# Altium schematic sheet Peripheral Connections.SchDoc
size A; SheetNumber: 9; SheetTotal: 9
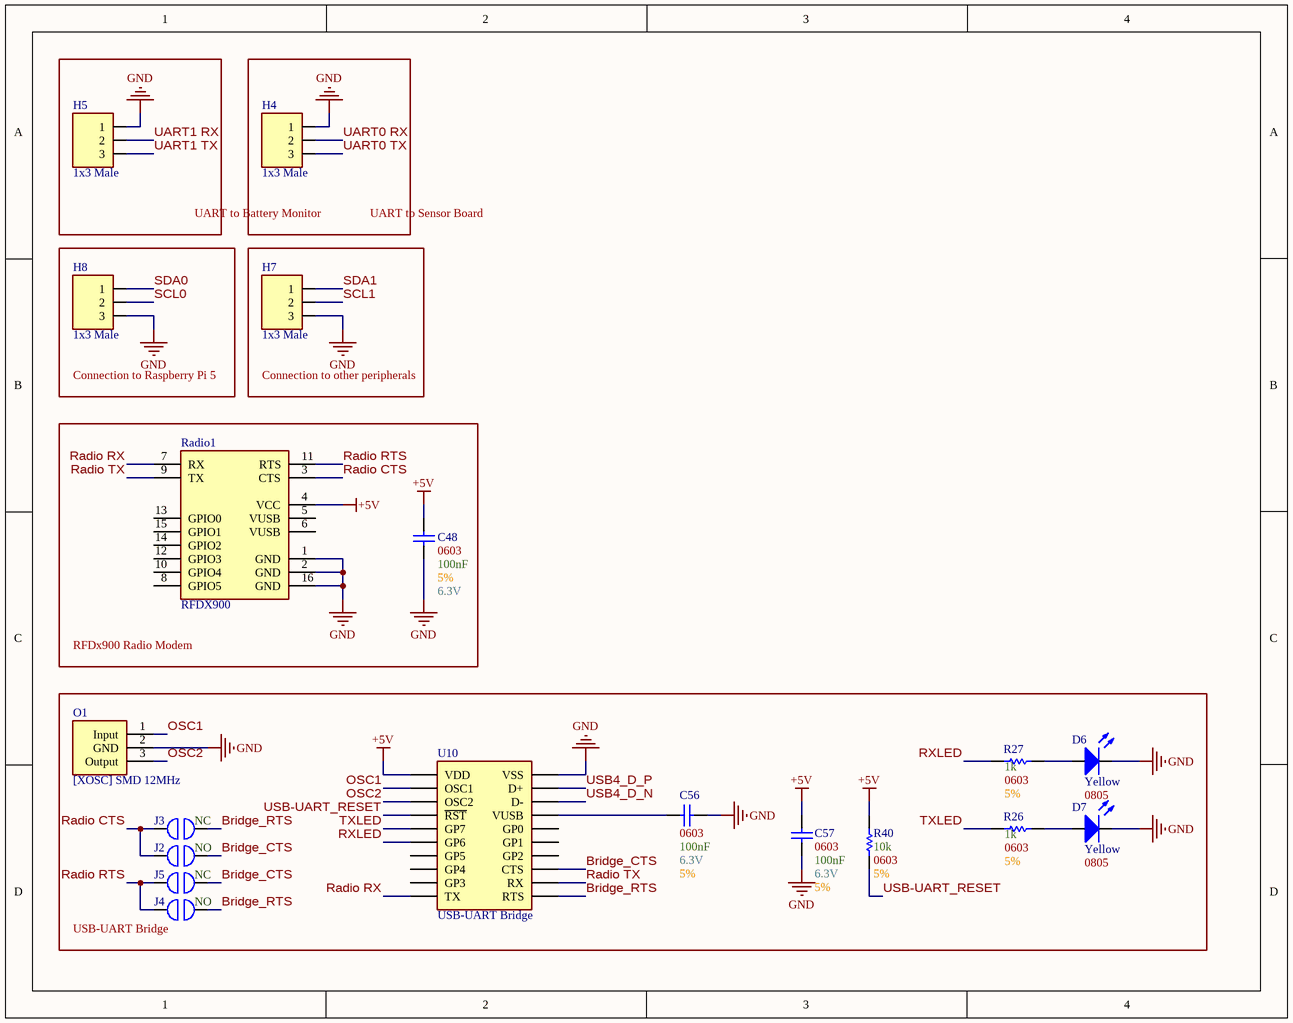
[diagram p0: Peripheral Connections.SchDoc]

## Parts
C48  Size Package: 0603  Capacitance: 100nF  Voltage: 6.3V  Tolerance: 5%  [[Cap] SMD 0603]  (hidden comment: [Cap] SMD Nonpolarized)
C56  Size Package: 0603  Capacitance: 100nF  Voltage: 6.3V  Tolerance: 5%  [[Cap] SMD 0603]  (hidden comment: [Cap] SMD Nonpolarized)
C57  Size Package: 0603  Capacitance: 100nF  Voltage: 6.3V  Tolerance: 5%  [[Cap] SMD 0603]  (hidden comment: [Cap] SMD Nonpolarized)
D6  Color: Yellow  Size Package: 0805  [[LED] SMD 0805]  (hidden comment: SMD LED)
D7  Color: Yellow  Size Package: 0805  [[LED] SMD 0805]  (hidden comment: SMD LED)
H4  1x3 Male  [[Header] Shrouded 1x3 Male]
H5  1x3 Male  [[Header] Shrouded 1x3 Male]
H7  1x3 Male  [[Header] Shrouded 1x3 Male]
H8  1x3 Male  [[Header] Shrouded 1x3 Male]
J2  NO/NC: NO  [[Jumper] Solderable Jumper]  (hidden comment: [Jump] SMD Jumper)  (no BOM)
J3  NO/NC: NC  [[Jumper] Solderable Jumper]  (hidden comment: [Jump] SMD Jumper)  (no BOM)
J4  NO/NC: NO  [[Jumper] Solderable Jumper]  (hidden comment: [Jump] SMD Jumper)  (no BOM)
J5  NO/NC: NC  [[Jumper] Solderable Jumper]  (hidden comment: [Jump] SMD Jumper)  (no BOM)
O1  [XOSC] SMD 12MHz  [[XOSC] SMD 12MHz]
R26  Resistance: 1k  Size Package: 0603  Tolerance: 5%  [[Res] SMD 0603]  (hidden comment: [Res] SMD Resistor)
R27  Resistance: 1k  Size Package: 0603  Tolerance: 5%  [[Res] SMD 0603]  (hidden comment: [Res] SMD Resistor)
R40  Resistance: 10k  Size Package: 0603  Tolerance: 5%  [[Res] SMD 0603]  (hidden comment: [Res] SMD Resistor)
Radio1  RFDX900  [[Device] RFDX900 Radio SMD Mount]
U10  USB-UART Bridge  [[IC] USB-UART Bridge]

## Blocks framed on the sheet
UART to Battery Monitor: H5
UART to Sensor Board: H4
Connection to Raspberry Pi 5: H8
Connection to other peripherals: H7
RFDx900 Radio Modem: C48 Radio1
USB-UART Bridge: C56 C57 D6 D7 J2-J5 O1 R26 R27 R40 U10

## Nets
+5V: C48.2 C57.2 R40.2 Radio1.4(VCC) U10.1(VDD)
GND: C48.1 C56.1 C57.1 D6.2(Cathode) D7.2(Cathode) H4.1 H5.1 H7.3 H8.3 O1.2(GND) Radio1.1(GND) Radio1.2(GND) Radio1.16(GND) U10.20(VSS)
Bridge_CTS: J2.2 J5.2 U10.13(CTS)
Bridge_RTS: J3.2 J4.2 U10.11(RTS)
OSC1: O1.1(Input) U10.2(OSC1)
OSC2: O1.3(Output) U10.3(OSC2)
Radio CTS: J2.1 J3.1 Radio1.3(CTS)
Radio RTS: J4.1 J5.1 Radio1.11(RTS)
Radio RX: Radio1.7(RX) U10.10(TX)
Radio TX: Radio1.9(TX) U10.12(RX)
RXLED: R27.2 U10.6(GP6)
SCL0: H8.2
SCL1: H7.2
SDA0: H8.1
SDA1: H7.1
TXLED: R26.2 U10.5(GP7)
UART0 RX: H4.2
UART0 TX: H4.3
UART1 RX: H5.2
UART1 TX: H5.3
USB4_D_N: U10.18(D-)
USB4_D_P: U10.19(D+)
USB-UART_RESET: R40.1 U10.4(~{RST})
NetC56_2: C56.2 U10.17(VUSB)
NetD6_1: D6.1(Anode) R27.1
NetD7_1: D7.1(Anode) R26.1

Not connected (* = marked no-connect by the designer): Radio1 5(VUSB) 6(VUSB) 8(GPIO5) 10(GPIO4) 12(GPIO3) 13(GPIO0) 14(GPIO2) 15(GPIO1); U10 7(GP5) 8(GP4) 9(GP3) 14(GP2) 15(GP1) 16(GP0)

## Library data of the parts
D6 D7 = [LED] SMD: Generic; Part #: *; Supplier 1: DigiKey; Supplier Part Number 1: 3147-B1701UY--20D000214U1930CT-ND
H4 H5 H7 H8 = [Header] Shrouded 1x3 Male: 070543-0037 / Mates with 005057-9403; Supplier 1: DigiKey; Supplier Part Number 1: WM4825-ND
  H4 H7 H8: Supplier 2: DigiKey; Supplier Part Number 2: WM2901-ND
J2-J5 = [Jump] SMD Jumper: Solderable jumper
R26 R27 R40 = [Res] SMD Resistor: Generic; Supplier 1: DigiKey
  R26 R27: Supplier Part Number 1: RMCF0603FT1K00DKR-ND
  R40: Supplier Part Number 1: 311-10.0KHRDKR-ND
Radio1 = [Device] RFDX900 Radio: RFDX900 Long-Range RF Module; Supplier 1: DigiKey; Supplier Part Number 1: 609-71609-308LF-ND
U10 = [IC] USB-UART Bridge: MCP2200T-I/SO; Supplier 1: DigiKey; Supplier Part Number 1: MCP2200T-I/SOCT-ND
C48 C56 C57 = [Cap] SMD Nonpolarized: Supplier 1: DigiKey; Supplier Part Number 1: 311-1088-6-ND
O1 = [XOSC] SMD 12MHz: Supplier 1: DigiKey; Supplier Part Number 1: 490-17947-1-ND